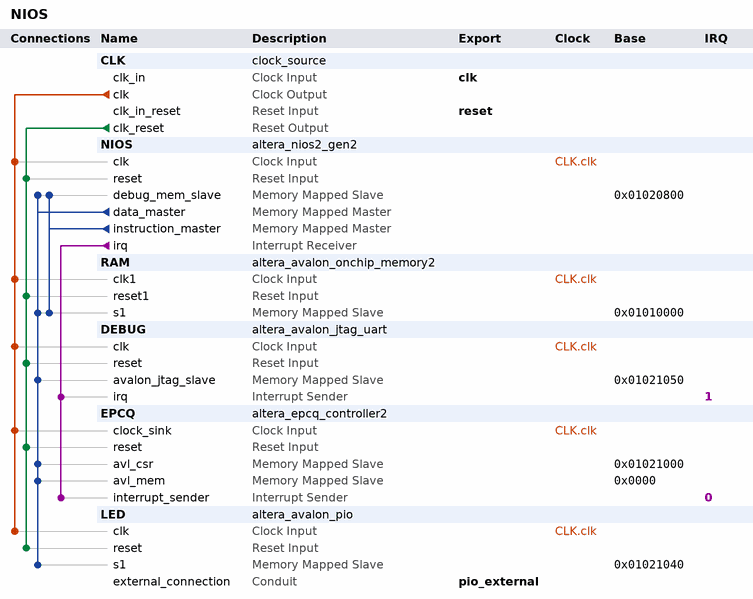
[diagram p0: system contents]
# Platform Designer (Qsys) system NIOS, Cyclone 10 LP 10CL025YU256I7G
# Parameters at their usual value, and those the tool derives, are not listed.
package require -exact qsys 23.1
create_system NIOS
set_project_property DEVICE_FAMILY {Cyclone 10 LP}
set_project_property DEVICE 10CL025YU256I7G

add_instance CLK clock_source 23.1
set_instance_parameter_value CLK clockFrequency 50000000

add_instance NIOS altera_nios2_gen2 23.1
set_instance_parameter_value NIOS dcache_size 2048
set_instance_parameter_value NIOS exceptionSlave RAM.s1
set_instance_parameter_value NIOS icache_size 4096
set_instance_parameter_value NIOS impl Tiny
set_instance_parameter_value NIOS resetSlave RAM.s1

add_instance RAM altera_avalon_onchip_memory2 23.1
set_instance_parameter_value RAM dataWidth 32
set_instance_parameter_value RAM dualPort false
set_instance_parameter_value RAM initMemContent true
set_instance_parameter_value RAM initializationFileName C:/Users/guan-ming.dennis-won/Documents/Code/FPGA_EPCQ_Programmer/software/NIOS/mem_init/onchip_mem.hex
set_instance_parameter_value RAM memorySize 40960
set_instance_parameter_value RAM useNonDefaultInitFile true

add_instance DEBUG altera_avalon_jtag_uart 23.1
set_instance_parameter_value DEBUG simInteractiveOptions NO_INTERACTIVE_WINDOWS

add_instance EPCQ altera_epcq_controller2 23.1
set_instance_parameter_value EPCQ CHIP_SELS 1
set_instance_parameter_value EPCQ DDASI 0
set_instance_parameter_value EPCQ FLASH_TYPE EPCQ128A
set_instance_parameter_value EPCQ IO_MODE STANDARD
set_instance_parameter_value EPCQ clkFreq 50000000

add_instance LED altera_avalon_pio 23.1
set_instance_parameter_value LED direction Output
set_instance_parameter_value LED resetValue 1
set_instance_parameter_value LED width 1

# connections
add_connection CLK.clk DEBUG.clk clock
add_connection CLK.clk EPCQ.clock_sink clock
add_connection CLK.clk LED.clk clock
add_connection CLK.clk NIOS.clk clock
add_connection CLK.clk RAM.clk1 clock
add_connection CLK.clk_reset DEBUG.reset reset
add_connection CLK.clk_reset EPCQ.reset reset
add_connection CLK.clk_reset LED.reset reset
add_connection CLK.clk_reset NIOS.reset reset
add_connection CLK.clk_reset RAM.reset1 reset
add_connection NIOS.data_master DEBUG.avalon_jtag_slave avalon
set_connection_parameter_value NIOS.data_master/DEBUG.avalon_jtag_slave baseAddress 0x01021050
add_connection NIOS.data_master EPCQ.avl_csr avalon
set_connection_parameter_value NIOS.data_master/EPCQ.avl_csr baseAddress 0x01021000
add_connection NIOS.data_master EPCQ.avl_mem avalon
set_connection_parameter_value NIOS.data_master/EPCQ.avl_mem baseAddress 0x0000
add_connection NIOS.data_master LED.s1 avalon
set_connection_parameter_value NIOS.data_master/LED.s1 baseAddress 0x01021040
add_connection NIOS.data_master NIOS.debug_mem_slave avalon
set_connection_parameter_value NIOS.data_master/NIOS.debug_mem_slave baseAddress 0x01020800
add_connection NIOS.data_master RAM.s1 avalon
set_connection_parameter_value NIOS.data_master/RAM.s1 baseAddress 0x01010000
add_connection NIOS.instruction_master NIOS.debug_mem_slave avalon
set_connection_parameter_value NIOS.instruction_master/NIOS.debug_mem_slave baseAddress 0x01020800
add_connection NIOS.instruction_master RAM.s1 avalon
set_connection_parameter_value NIOS.instruction_master/RAM.s1 baseAddress 0x01010000
add_connection NIOS.irq DEBUG.irq interrupt
set_connection_parameter_value NIOS.irq/DEBUG.irq irqNumber 1
add_connection NIOS.irq EPCQ.interrupt_sender interrupt
set_connection_parameter_value NIOS.irq/EPCQ.interrupt_sender irqNumber 0

# exported interfaces
add_interface clk clock sink
set_interface_property clk EXPORT_OF CLK.clk_in
add_interface pio_external conduit end
set_interface_property pio_external EXPORT_OF LED.external_connection
add_interface reset reset sink
set_interface_property reset EXPORT_OF CLK.clk_in_reset

set_interconnect_requirement {$system} qsys_mm.clockCrossingAdapter HANDSHAKE
set_interconnect_requirement {$system} qsys_mm.enableEccProtection FALSE
set_interconnect_requirement {$system} qsys_mm.insertDefaultSlave FALSE
set_interconnect_requirement {$system} qsys_mm.maxAdditionalLatency 1

save_system NIOS.qsys
